# Altium schematic sheet Proto_Schematic.SchDoc
size A3; SheetNumber: 2; SheetTotal: 2
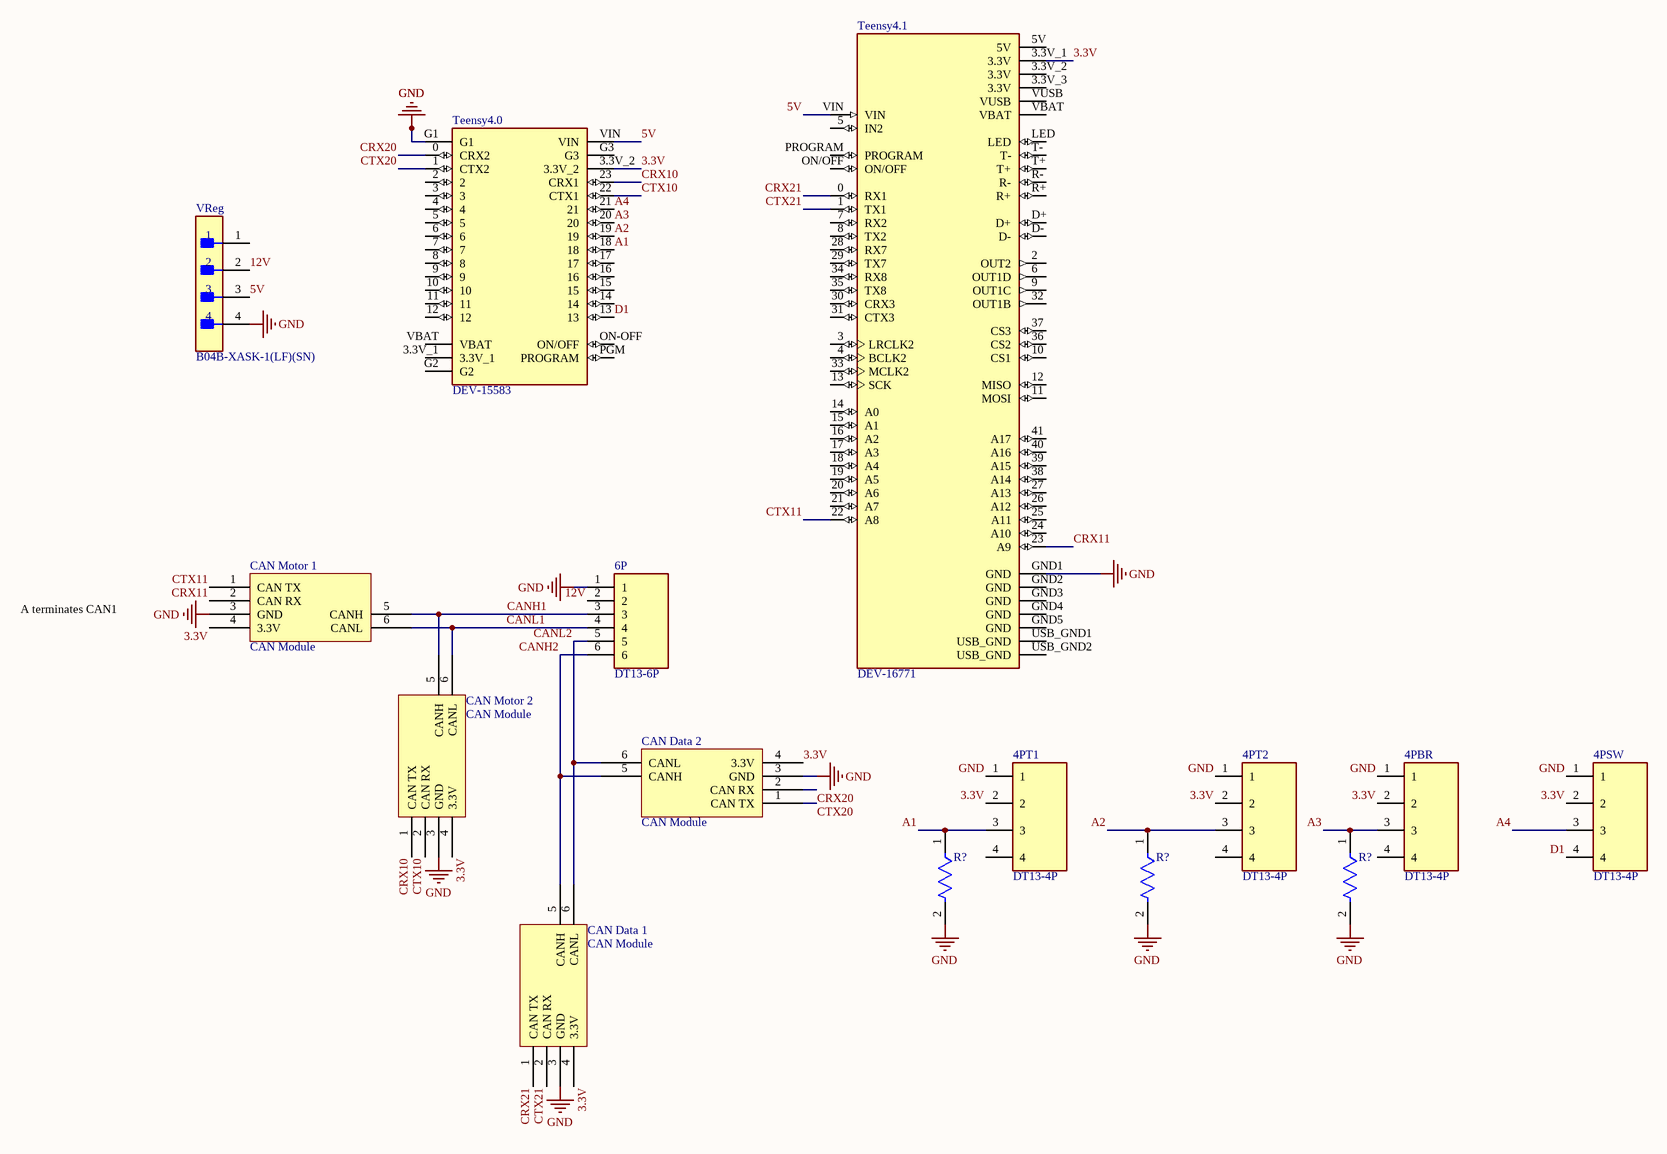
[diagram p0: Proto_Schematic.SchDoc]

## Parts
(Parts that share a designator on the sheet are numbered #1, #2 ... from top to bottom, then left to right.)
4PBR  DT13-4P  [TE_DT13-4P]
4PSW  DT13-4P  [TE_DT13-4P]
4PT1  DT13-4P  [TE_DT13-4P]
4PT2  DT13-4P  [TE_DT13-4P]
6P  DT13-6P  [TE_DT13-6P]
CAN_Data_1  CAN Module  [CAN Module-Footprint-1]
CAN_Data_2  CAN Module  [CAN Module-Footprint-1]
CAN_Motor_1  CAN Module  [CAN Module-Footprint-1]
CAN_Motor_2  CAN Module  [CAN Module-Footprint-1]
R?#1  RP73D1J10KBTDG  [FP-RP731J-MFG]  (value not drawn)
R?#2  RP73D1J10KBTDG  [FP-RP731J-MFG]  (value not drawn)
R?#3  RP73D1J10KBTDG  [FP-RP731J-MFG]  (value not drawn)
Teensy4.0  DEV-15583  [MODULE_DEV-15583]
Teensy4.1  DEV-16771  [MODULE_DEV-16771]
VReg  B04B-XASK-1(LF)(SN)  [FP-B04B-XASK-1_LF_SN-MFG]

## Nets
GND: 4PBR.1 4PSW.1 4PT1.1 4PT2.1 6P.1 CAN_Data_1.3(GND) CAN_Data_2.3(GND) CAN_Motor_1.3(GND) CAN_Motor_2.3(GND) R?#1.2 R?#2.2 R?#3.2 Teensy4.0.G1 Teensy4.1.GND1(GND) VReg.4
3.3V: 4PBR.2 4PSW.2 4PT1.2 4PT2.2 CAN_Data_1.4(3.3V) CAN_Data_2.4(3.3V) CAN_Motor_1.4(3.3V) CAN_Motor_2.4(3.3V) Teensy4.0.3.3V_2 Teensy4.1.3.3V_1(3.3V)
5V: Teensy4.0.VIN Teensy4.1.VIN VReg.3
12V: 6P.2 VReg.2
A1: 4PT1.3 R?#1.1 Teensy4.0.18
A2: 4PT2.3 R?#2.1 Teensy4.0.19
A3: 4PBR.3 R?#3.1 Teensy4.0.20
A4: 4PSW.3 Teensy4.0.21
CANH1: 6P.3 CAN_Motor_1.5(CANH) CAN_Motor_2.5(CANH)
CANH2: 6P.6 CAN_Data_1.5(CANH) CAN_Data_2.5(CANH)
CANL1: 6P.4 CAN_Motor_1.6(CANL) CAN_Motor_2.6(CANL)
CANL2: 6P.5 CAN_Data_1.6(CANL) CAN_Data_2.6(CANL)
CRX10: CAN_Motor_2.1(CAN_TX) Teensy4.0.23(CRX1)
CRX11: CAN_Motor_1.2(CAN_RX) Teensy4.1.23(A9)
CRX20: CAN_Data_2.2(CAN_RX) Teensy4.0.0(CRX2)
CRX21: CAN_Data_1.1(CAN_TX) Teensy4.1.0(RX1)
CTX10: CAN_Motor_2.2(CAN_RX) Teensy4.0.22(CTX1)
CTX11: CAN_Motor_1.1(CAN_TX) Teensy4.1.22(A8)
CTX20: CAN_Data_2.1(CAN_TX) Teensy4.0.1(CTX2)
CTX21: CAN_Data_1.2(CAN_RX) Teensy4.1.1(TX1)
D1: 4PSW.4 Teensy4.0.13

Not connected (* = marked no-connect by the designer): 4PBR 4; 4PT1 4; 4PT2 4; Teensy4.0 2 3 3.3V_1 4 5 6 7 8 9 10 11 12 14 15 16 17 G2 G3 ON-OFF(ON/OFF) PGM(PROGRAM) VBAT; Teensy4.1 2(OUT2) 3(LRCLK2) 3.3V_2(3.3V) 3.3V_3(3.3V) 4(BCLK2) 5(IN2) 5V 6(OUT1D) 7(RX2) 8(TX2) 9(OUT1C) 10(CS1) 11(MOSI) 12(MISO) 13(SCK) 14(A0) 15(A1) 16(A2) 17(A3) 18(A4) 19(A5) 20(A6) 21(A7) 24(A10) 25(A11) 26(A12) 27(A13) 28(RX7) 29(TX7) 30(CRX3) 31(CTX3) 32(OUT1B) 33(MCLK2) 34(RX8) 35(TX8) 36(CS2) 37(CS3) 38(A14) 39(A15) 40(A16) 41(A17) D+ D- GND2(GND) GND3(GND) GND4(GND) GND5(GND) LED ON/OFF PROGRAM R+ R- T+ T- USB_GND1(USB_GND) USB_GND2(USB_GND) VBAT VUSB; VReg 1

## Notes on the sheet
- A terminates CAN1

## Library data of the parts
4PBR 4PSW 4PT1 4PT2 = DT13-4P: DT13 Series, 4.44mm Pitch 4 Way 2 Row Right Angle PCB Header, Solder Termination; MF: TE Connectivity; SnapEDA_Link: https://www.snapeda.com/parts/DT13-4P/TE%20Connectivity%20Deutsch%20Connectors/view-part/2708791/?ref=snap; MP: DT13-4P; TE_purchase_URL: https://www.te.com/usa-en/product-DT13-4P.html?te_bu=Cor&te_type=disp&te_campaign=seda_glo_cor-seda-global-disp-prtnr-fy19-seda-model-bom-cta_sma-317_1&elqCampaignId=32493; Availability: Unavailable; Value: *; Price: None; Package: None
6P = DT13-6P: DT13 Series, 4.44mm Pitch 6 Way 2 Row Right Angle PCB Header, Solder Termination; MF: TE Connectivity; DigiKey-Purchase-URL: https://snapeda.com/shop?store=DigiKey&id=1897474; Value: *; SnapEDA_Link: https://www.snapeda.com/parts/DT13-6P/TE%20Connectivity%20Deutsch%20Connectors/view-part/1897474/?ref=snap; EU_RoHS_Compliance: Compliant; Availability: Unavailable; Price: None; Package: None; MP: DT13-6P
CAN_Data_1 CAN_Data_2 CAN_Motor_1 CAN_Motor_2 = CMP-00030-00003-1: CAN waveshare
R?#1-R?#3 = CMP-03211-006887-1: TE CONNECTIVITY / HOLSWORTHY SMD Chip Resistor, Thin Film, 10KΩ, 50 V, 0603 [1608 Metric], 100 mW, 0.1% , RP73 Series; Voltage Rating: 75V; Power Rating: 0.1W; Temperature Coefficient: 15ppm/°C; Lead Free: Yes; Tolerance: 0.1%; Category: Res; Ipc Land Pattern Name: RESC15580X45; Composition: Thin Film; octopart_url: https://octopart.com/rp73d1j10kbtdg-te+connectivity-42631518; ComponentLink2URL: https://www.te.com/commerce/DocumentDelivery/DDEController?Action=srchrtrv&DocNm=1773272&DocType=DS&DocLang=English; Device Class L1: Passive Components; packaging: cut tape; Device Class L3: Chip SMD Resistors; Temperature Range Low: -55°C; Package: RP731J; Value: 10KΩ; ComponentLink2Description: Datasheet; RoHS: TRUE; Temperature: -55°C to +105°C; Height: 0.55mm; Automotive: No; Resistance: 10KΩ; Series: RP73; Octopart: https://octopart.com/rp73d1j10kbtdg-te+connectivity-42631518; Manufacturer: TE Connectivity; Temperature Range High: +105°C; Manufacturer Part Number: RP73D1J10KBTDG; Device Class L2: Resistors
Teensy4.0 = DEV-15583: RT1062 Teensy 4.0 i.MX ARMÂ® CortexÂ®-M7 MPU Embedded Evaluation Board; MF: SparkFun Electronics; Value: *; Package: None; Digi-Key_Part_Number: 1568-DEV-15583-ND; Digi-Key_Purchase_URL: https://www.digikey.com/product-detail/en/sparkfun-electronics/DEV-15583/1568-DEV-15583-ND/10384551?utm_source=snapeda&utm_medium=aggregator&utm_campaign=symbol; MP: DEV-15583; SnapEDA_Link: https://www.snapeda.com/parts/DEV-15583/SparkFun%20Electronics/view-part/4001229/?ref=snap
Teensy4.1 = DEV-16771: RT1062 Teensy 4.1 series ARM® Cortex®-M7 MPU Embedded Evaluation Board; MF: SparkFun Electronics; SnapEDA_Link: https://www.snapeda.com/parts/DEV-16771/SparkFun+Electronics/view-part/?ref=snap; Package: None; Value: *; MP: DEV-16771; Check_prices: https://www.snapeda.com/parts/DEV-16771/SparkFun+Electronics/view-part/?ref=eda
VReg = CMP-17439-000018-1: CONN HEADER VERT 4POS 2.5MM; Manufacturer: JST; Current Rating: 3A; Voltage Rating: 250V; Conn Orientation: Straight; Conn Gender: Male; Number Of Contacts: 4; ComponentLink2Description: Datasheet; Package: B04B-XASK-1(LF)(SN); Octopart: https://octopart.com/b04b-xask-1%28lf%29%28sn%29-jst-3990149; Pitch: 2.5mm; Device Class L1: Connectors; RoHS: TRUE; Device Class L3: unset; Manufacturer Part Number: B04B-XASK-1(LF)(SN); Temperature Range High: +85°C; Height: 8.8mm; Lead Free: Yes; Category: Conn; Temperature: -25°C to +85°C; Digikey Description: CONN HEADER VERT 4POS 2.5MM; Temperature Range Low: -25°C; ComponentLink2URL: http://www.jst-mfg.com/product/pdf/eng/eXA1.pdf; Contact Material: Tin,Copper; Device Class L2: Headers and Wire Housings; Automotive: No; Number Of Rows: 1